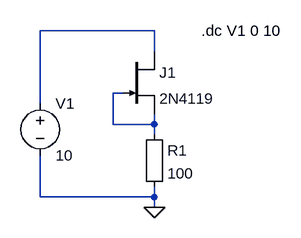
[diagram p0: schematic currect regulator.asc]
currect regulator.asc, the LTspice schematic file:
Version 4
SHEET 1 880 680
WIRE 208 48 32 48
WIRE 208 80 208 48
WIRE 160 144 144 144
WIRE 32 160 32 48
WIRE 144 192 144 144
WIRE 208 192 208 176
WIRE 208 192 144 192
WIRE 208 208 208 192
WIRE 32 304 32 240
WIRE 208 304 208 288
WIRE 208 304 32 304
WIRE 208 320 208 304
FLAG 208 320 0
SYMBOL njf 160 80 R0
SYMATTR InstName J1
SYMATTR Value 2N4119
SYMBOL Misc\\EuropeanResistor 192 192 R0
SYMATTR InstName R1
SYMATTR Value 100
SYMBOL voltage 32 144 R0
WINDOW 123 0 0 Left 0
WINDOW 39 0 0 Left 0
SYMATTR InstName V1
SYMATTR Value 10
TEXT 280 48 Left 2 !.dc V1 0 10

The netlist it stands for:
* currect regulator.asc
J1 N001 N002 N002 2N4119
R1 N002 0 100
V1 N001 0 10
.model NJF NJF
.model PJF PJF
.lib standard.jft
.dc V1 0 10
.backanno
.end